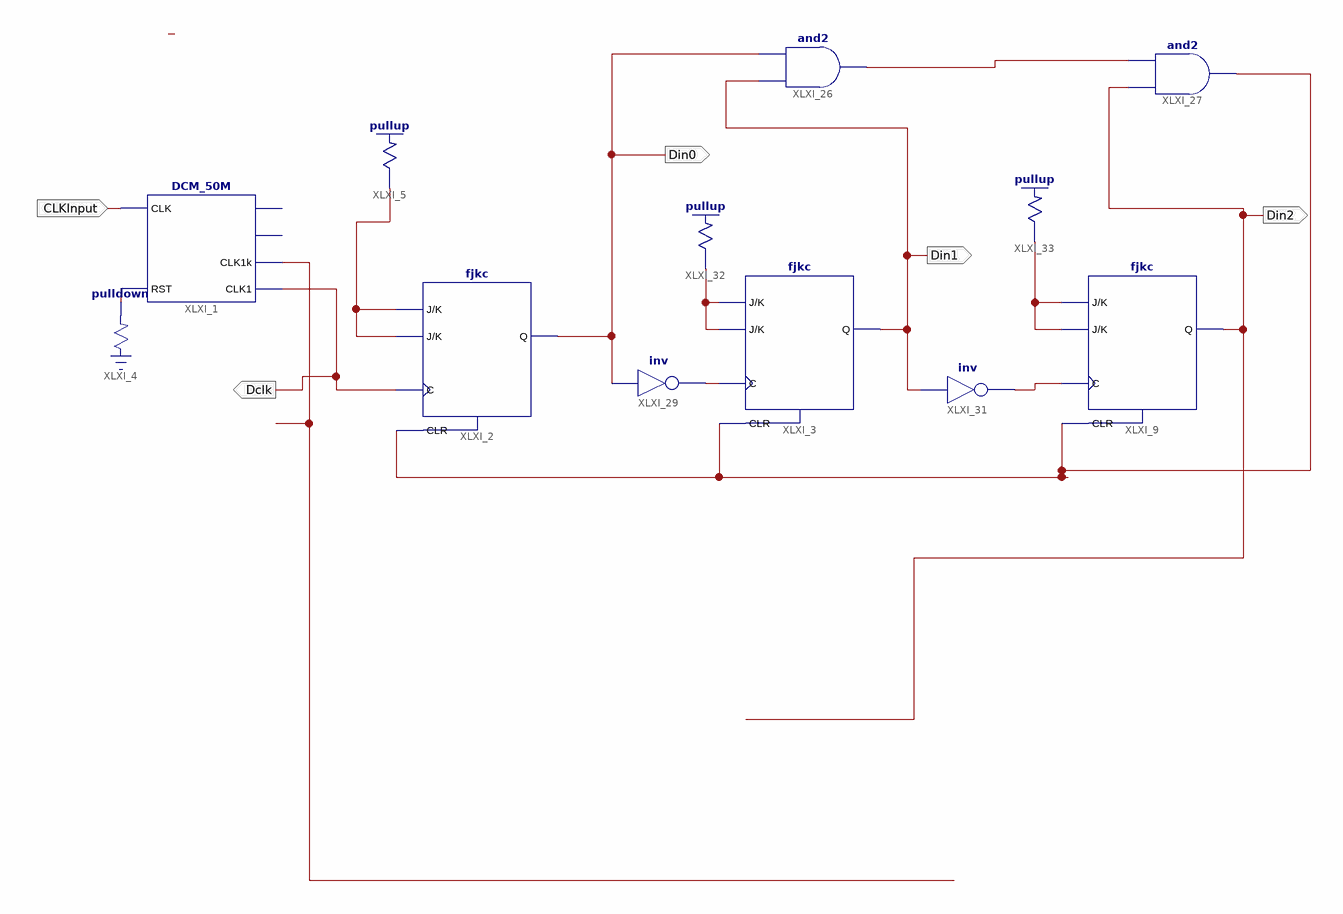
[diagram p0: schematic sheet 1]
// Xilinx ISE schematic lab8_experiment3.sch (spartan3e) as structural Verilog: 12 symbols, 5 ports
module lab8_experiment3 (
  input  CLKInput,
  output Din2,
  output Dclk,
  output Din0,
  output Din1
);

  wire XLXN_2, XLXN_3, XLXN_29, XLXN_45, XLXN_82, XLXN_89, XLXN_90, XLXN_97, XLXN_101;

  DCM_50M XLXI_1 (.CLK(CLKInput), .RST(XLXN_2), .CLK1k(XLXN_29), .CLK1(Dclk));  // open: CLK1M, CLK10k
  fjkc XLXI_2 (.C(Dclk), .CLR(XLXN_45), .J(XLXN_3), .K(XLXN_3), .Q(Din0));
  fjkc XLXI_3 (.C(XLXN_82), .CLR(XLXN_45), .J(XLXN_97), .K(XLXN_97), .Q(Din1));
  \pulldown  XLXI_4 (.O(XLXN_2));
  \pullup  XLXI_5 (.O(XLXN_3));
  fjkc XLXI_9 (.C(XLXN_89), .CLR(XLXN_45), .J(XLXN_101), .K(XLXN_101), .Q(Din2));
  and XLXI_26 (XLXN_90, Din1, Din0);
  and XLXI_27 (XLXN_45, Din2, XLXN_90);
  not XLXI_29 (XLXN_82, Din0);
  not XLXI_31 (XLXN_89, Din1);
  \pullup  XLXI_32 (.O(XLXN_97));
  \pullup  XLXI_33 (.O(XLXN_101));
endmodule
